# Altium schematic sheet Sheet_circuit.SchDoc
size A4; SheetNumber: 1; SheetTotal: 1
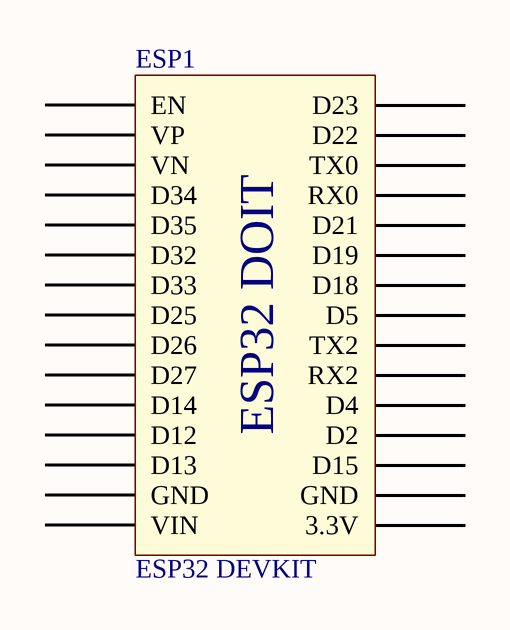
[diagram p0: Sheet_circuit.SchDoc]

## Parts
ESP1  ESP32 DEVKIT  [ESP32 WROOM 32 KIT]

## Nets

Not connected (* = marked no-connect by the designer): ESP1 1(EN) 2(VP) 3(VN) 4(D34) 5(D35) 6(D32) 7(D33) 8(D25) 9(D26) 10(D27) 11(D14) 12(D12) 13(D13) 14(GND) 15(VIN) 16(3.3V) 17(GND) 18(D15) 19(D2) 20(D4) 21(RX2) 22(TX2) 23(D5) 24(D18) 25(D19) 26(D21) 27(RX0) 28(TX0) 29(D22) 30(D23)

## Notes on the sheet
- (in symbol ESP32 WROOM 32 KIT) ESP32 DOIT

## Library data of the parts
ESP1 = ESP32 WROOM 32 KIT